# EAGLE schematic Noise Generator (EAGLE 8.2.1)
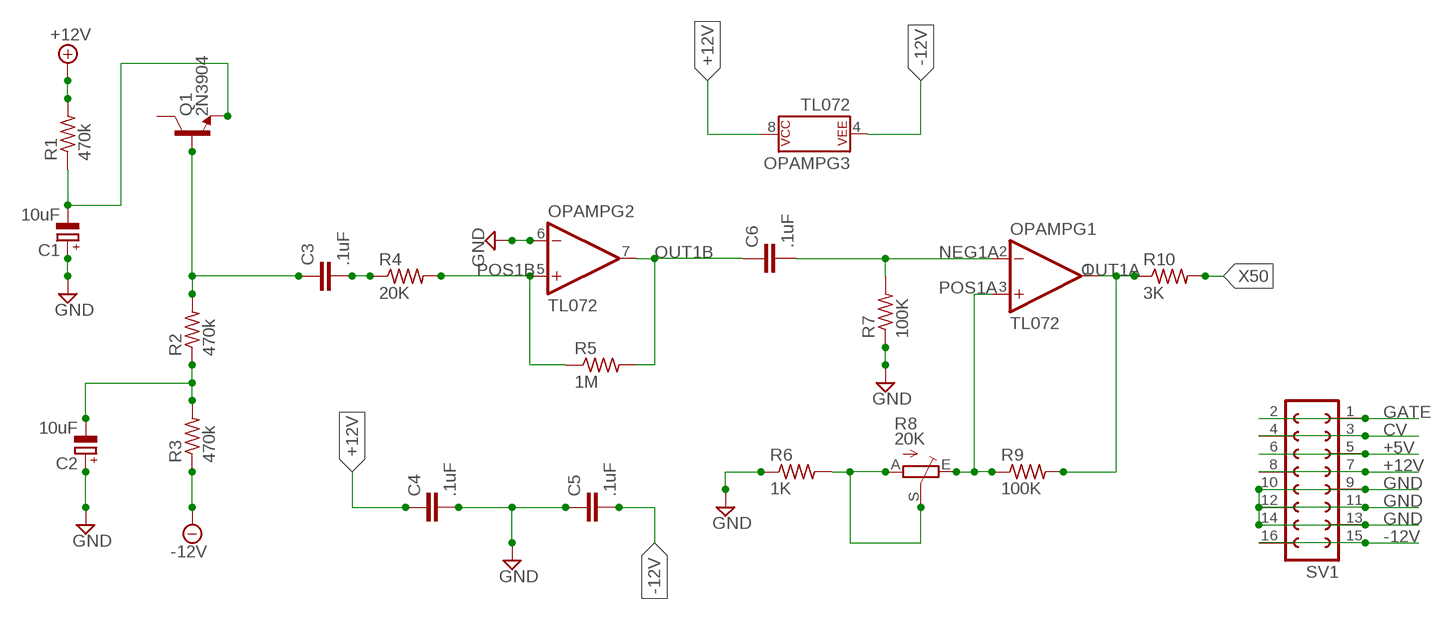
[diagram p0: schematic, sheet 1]

## Parts
C1  10uF  CPOL-EUE2-4  [E2-4]
C2  10uF  CPOL-EUE2-4  [E2-4]
C3  .1uF  C-EU025-024X044  [C025-024X044]
C4  .1uF  C-EU025-024X044  [C025-024X044]
C5  .1uF  C-EU025-024X044  [C025-024X044]
C6  .1uF  C-EU025-024X044  [C025-024X044]
OPAMP  TL072  OPAMP-DUALU  [SO08]
Q1  2N3904  TRANS_NPN-2N3904  [TO-92]
R1  470k  R-US_0309/12  [0309/12]
R2  470k  R-US_0309/12  [0309/12]
R3  470k  R-US_0309/12  [0309/12]
R4  20K  R-US_0309/12  [0309/12]
R5  1M  R-US_0309/12  [0309/12]
R6  1K  R-US_0309/12  [0309/12]
R7  100K  R-US_0309/12  [0309/12]
R8  20K  TRIM_EU-RJ9W  [RJ9W]
R9  100K  R-US_0309/12  [0309/12]
R10  3K  R-US_0309/12  [0309/12]
SV1  FE08-2  [FE08-2]

## Nets
+5V: SV1.5 SV1.6
+12V: C4.1 OPAMP.8(P$V+) R1.2 SV1.7 SV1.8
-12V: C5.2 OPAMP.4(P$V-) R3.1 SV1.15 SV1.16
CV: SV1.3 SV1.4
GATE: SV1.1 SV1.2
GND: C1.+ C2.+ C4.2 C5.1 OPAMP.6(-IN) R6.1 R7.1 SV1.9 SV1.10 SV1.11 SV1.12 SV1.13 SV1.14
N$1: C2.- R2.1 R3.2
N$2: C1.- Q1.1(E) R1.1
N$5: R6.2 R8.A R8.S
N$11: C3.2 R4.1
N$12: C3.1 Q1.2(B) R2.2
NEG1A: C6.2 OPAMP.2(-IN) R7.2
OUT1A: OPAMP.1(OUT) R9.2 R10.1
OUT1B: C6.1 OPAMP.7(OUT) R5.2
POS1A: OPAMP.3(+IN) R8.E R9.1
POS1B: OPAMP.5(+IN) R4.2 R5.1
X50: R10.2
Unconnected: Q1.3(C)

## Library data of the parts
C1 C2 = rcl:CPOL-EU: POLARIZED CAPACITOR, European symbol
C3-C6 = resistor:C-EU: CAPACITOR, European symbol
OPAMP = SparkFun-IC-Amplifiers:OPAMP-DUAL: Generic op-amp footprint This component is for the standard 358 pinning of a dual op-amp From the LM358 datasheet: Pin 1: Output A Pin 2: Inverting Input A Pin 3: Non-Inverting Input A Pin 4: Gnd Pin 5: Non-Inverting Input B Pin 6: Inverting Input B Pin 7: Output B Pin 8: V+; PROD_ID: NA-XXXXX; VALUE: OP-AMP
Q1 = SparkFun-DiscreteSemi:TRANS_NPN: NPN transistor Current controlled devices typically used to amplify current or used as a switch. BC547 - COM-08928 <http://www.sparkfun.com/products/8928> (TO-92 45V 100mA) (1.Collector 2.Base 3.Emitter) 2N3904 - COM-00521 <http://www.sparkfun.com/products/521> (TO-92 40V 200mA) (1.Emitter 2.Base 3.Collector) P2N2222A - COM-12852 <http://www.sparkfun.com/products/12852> (TO-92 40V 600mA) (1.Collector 2.Base 3.Emitter); PROD_ID: TRANS-08447; VALUE: 200mA/40V
R1-R7 R9 R10 = resistor:R-US_: RESISTOR, American symbol
R8 = pot:TRIM_EU-: POTENTIOMETER
SV1 = con-lsta:FE08-2: FEMALE HEADER; OC_FARNELL: unknown; OC_NEWARK: unknown

## Net classes
0 default: width 0.305 mm, drill 0.127 mm, clearance 0.254 mm